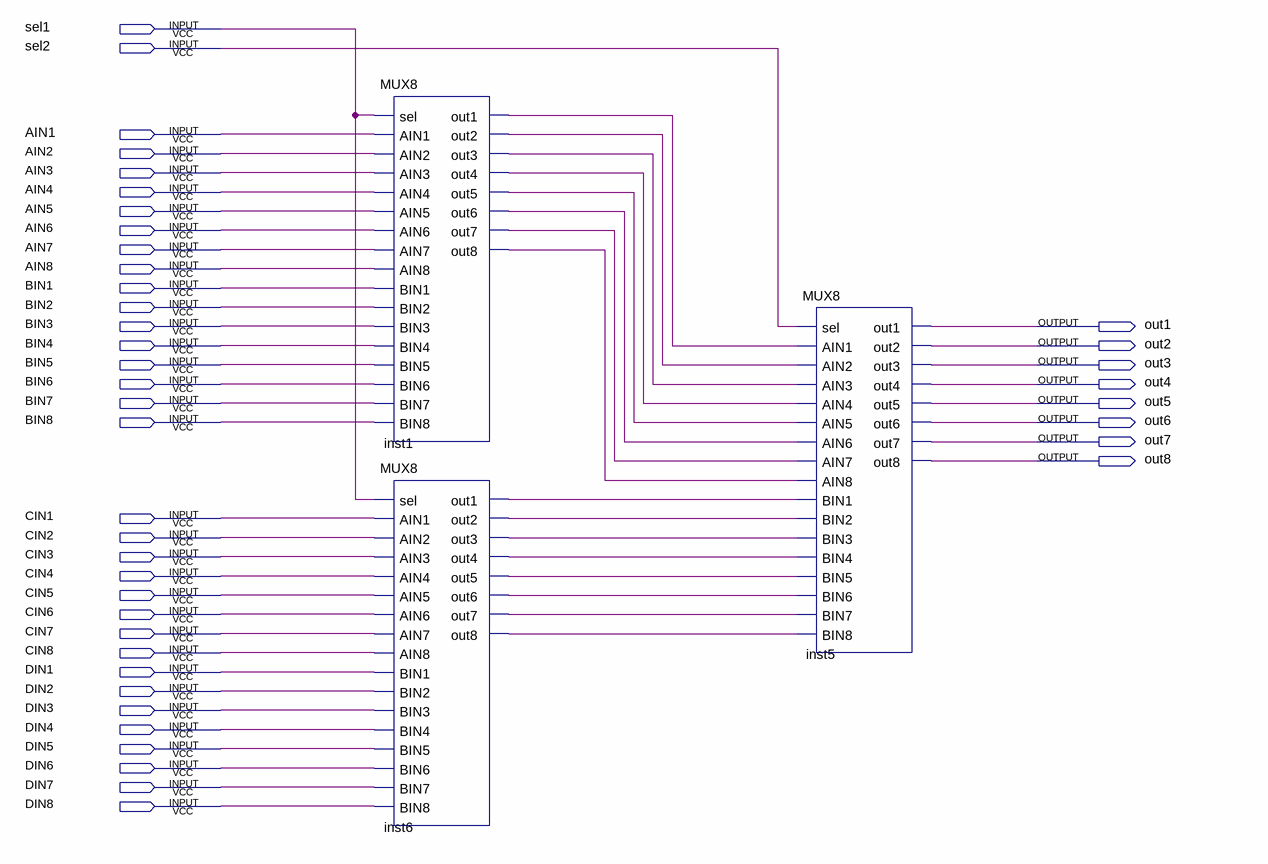
[diagram p0: schematic sheet]
// Quartus schematic CounterMUX.bdf as structural Verilog: 3 symbols, 42 pins
module CounterMUX (
  input  sel1,
  input  sel2,
  input  AIN1,
  input  AIN2,
  input  AIN3,
  input  AIN4,
  input  AIN5,
  input  AIN6,
  input  AIN7,
  input  AIN8,
  input  BIN1,
  input  BIN2,
  input  BIN3,
  input  BIN4,
  input  BIN5,
  input  BIN6,
  input  BIN7,
  input  BIN8,
  input  CIN1,
  input  CIN2,
  input  CIN3,
  input  CIN4,
  input  CIN5,
  input  CIN6,
  input  CIN7,
  input  CIN8,
  input  DIN1,
  input  DIN2,
  input  DIN3,
  input  DIN4,
  input  DIN5,
  input  DIN6,
  input  DIN7,
  input  DIN8,
  output out1,
  output out2,
  output out3,
  output out4,
  output out5,
  output out6,
  output out7,
  output out8
);

  wire inst1_out1, inst1_out2, inst1_out3, inst1_out4, inst1_out5, inst1_out6, inst1_out7, inst1_out8,
       inst6_out1, inst6_out2, inst6_out3, inst6_out4, inst6_out5, inst6_out6, inst6_out7, inst6_out8;

  MUX8 inst1 (
    .sel(sel1), .AIN1(AIN1), .AIN2(AIN2), .AIN3(AIN3), .AIN4(AIN4), .AIN5(AIN5), .AIN6(AIN6), .AIN7(AIN7),
    .AIN8(AIN8), .BIN1(BIN1), .BIN2(BIN2), .BIN3(BIN3), .BIN4(BIN4), .BIN5(BIN5), .BIN6(BIN6), .BIN7(BIN7),
    .BIN8(BIN8), .out1(inst1_out1), .out2(inst1_out2), .out3(inst1_out3), .out4(inst1_out4),
    .out5(inst1_out5), .out6(inst1_out6), .out7(inst1_out7), .out8(inst1_out8));
  MUX8 inst6 (
    .sel(sel1), .AIN1(CIN1), .AIN2(CIN2), .AIN3(CIN3), .AIN4(CIN4), .AIN5(CIN5), .AIN6(CIN6), .AIN7(CIN7),
    .AIN8(CIN8), .BIN1(DIN1), .BIN2(DIN2), .BIN3(DIN3), .BIN4(DIN4), .BIN5(DIN5), .BIN6(DIN6), .BIN7(DIN7),
    .BIN8(DIN8), .out1(inst6_out1), .out2(inst6_out2), .out3(inst6_out3), .out4(inst6_out4),
    .out5(inst6_out5), .out6(inst6_out6), .out7(inst6_out7), .out8(inst6_out8));
  MUX8 inst5 (
    .sel(sel2), .AIN1(inst1_out1), .AIN2(inst1_out2), .AIN3(inst1_out3), .AIN4(inst1_out4),
    .AIN5(inst1_out5), .AIN6(inst1_out6), .AIN7(inst1_out7), .AIN8(inst1_out8), .BIN1(inst6_out1),
    .BIN2(inst6_out2), .BIN3(inst6_out3), .BIN4(inst6_out4), .BIN5(inst6_out5), .BIN6(inst6_out6),
    .BIN7(inst6_out7), .BIN8(inst6_out8), .out1(out1), .out2(out2), .out3(out3), .out4(out4), .out5(out5),
    .out6(out6), .out7(out7), .out8(out8));
endmodule
